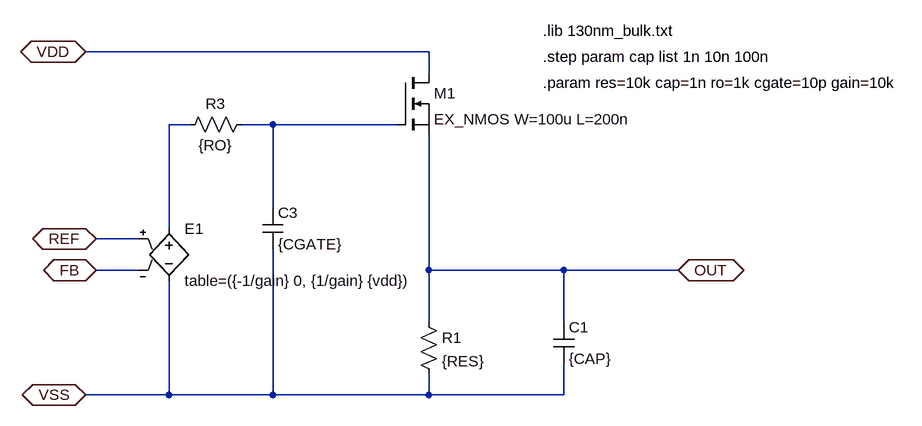
[diagram p0: schematic fake_reference.asc]
fake_reference.asc, the LTspice schematic file:
Version 4
SHEET 1 880 680
WIRE 0 -176 -528 -176
WIRE 0 -144 0 -176
WIRE -368 -64 -400 -64
WIRE -240 -64 -288 -64
WIRE -48 -64 -240 -64
WIRE -240 64 -240 -64
WIRE -400 96 -400 -64
WIRE -448 112 -512 112
WIRE -448 160 -512 160
WIRE 0 160 0 -48
WIRE 208 160 0 160
WIRE 384 160 208 160
WIRE 0 240 0 160
WIRE 208 240 208 160
WIRE -400 352 -400 176
WIRE -400 352 -528 352
WIRE -240 352 -240 128
WIRE -240 352 -400 352
WIRE 0 352 0 320
WIRE 0 352 -240 352
WIRE 208 352 208 304
WIRE 208 352 0 352
FLAG 384 160 OUT
IOPIN 384 160 BiDir
FLAG -528 -176 VDD
IOPIN -528 -176 BiDir
FLAG -512 112 REF
IOPIN -512 112 BiDir
FLAG -512 160 FB
IOPIN -512 160 BiDir
FLAG -528 352 VSS
IOPIN -528 352 BiDir
SYMBOL e -400 80 R0
SYMATTR InstName E1
SYMATTR Value table=({-1/gain} 0, {1/gain} {vdd})
SYMBOL res -16 224 R0
SYMATTR InstName R1
SYMATTR Value {RES}
SYMBOL cap 192 240 R0
SYMATTR InstName C1
SYMATTR Value {CAP}
SYMBOL nmos -48 -144 R0
SYMATTR InstName M1
SYMATTR Value EX_NMOS W=100u L=200n
SYMBOL res -272 -80 R90
WINDOW 0 0 56 VBottom 2
WINDOW 3 32 56 VTop 2
SYMATTR InstName R3
SYMATTR Value {RO}
SYMBOL cap -256 64 R0
SYMATTR InstName C3
SYMATTR Value {CGATE}
TEXT 176 -208 Left 2 !.lib 130nm_bulk.txt
TEXT 176 -128 Left 2 !.param res=10k cap=1n ro=1k cgate=10p gain=10k
TEXT 176 -168 Left 2 !.step param cap list 1n 10n 100n

The netlist it stands for:
* fake_reference.asc
E1 N001 VSS REF FB table=({-1/gain} 0, {1/gain} {vdd})
R1 OUT VSS {RES}
C1 OUT VSS {CAP}
M1 VDD N002 OUT OUT EX_NMOS W=100u L=200n
R3 N002 N001 {RO}
C3 N002 VSS {CGATE}
.model NMOS NMOS
.model PMOS PMOS
.lib standard.mos
.lib 130nm_bulk.txt
.param res=10k cap=1n ro=1k cgate=10p gain=10k
.step param cap list 1n 10n 100n
.backanno
.end